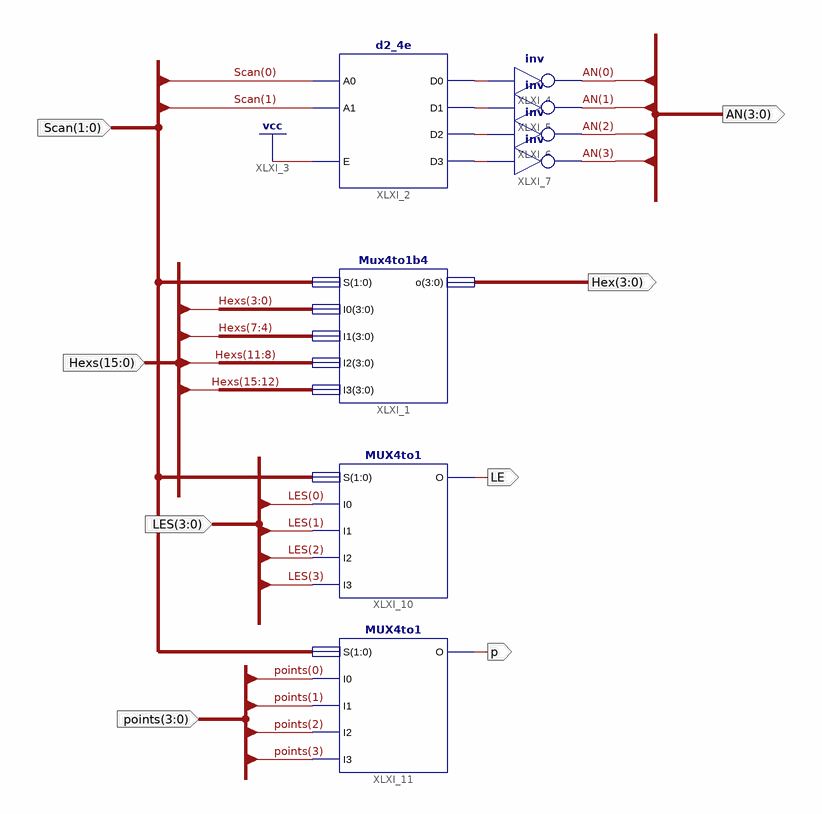
[diagram p0: schematic sheet 1]
// Xilinx ISE schematic DisplaySync.sch (kintex7) as structural Verilog: 8 symbols, 8 ports
module DisplaySync (
  input  [1:0] Scan,
  input  [15:0] Hexs,
  input  [3:0] LES,
  input  [3:0] points,
  output [3:0] Hex,
  output [3:0] AN,
  output p,
  output LE
);

  wire XLXN_13, XLXN_21, XLXN_22, XLXN_23;

  Mux4to1b4 XLXI_1 (.S(Scan), .I0(Hexs[3:0]), .I1(Hexs[7:4]), .I2(Hexs[11:8]), .I3(Hexs[15:12]), .o(Hex));
  d2_4e XLXI_2 (.A0(Scan[0]), .A1(Scan[1]), .E(1'b1), .D0(XLXN_21), .D1(XLXN_22), .D2(XLXN_23), .D3(XLXN_13));
  not XLXI_4 (AN[0], XLXN_21);
  not XLXI_5 (AN[1], XLXN_22);
  not XLXI_6 (AN[2], XLXN_23);
  not XLXI_7 (AN[3], XLXN_13);
  MUX4to1 XLXI_10 (.S(Scan), .I0(LES[0]), .I1(LES[1]), .I2(LES[2]), .I3(LES[3]), .O(LE));
  MUX4to1 XLXI_11 (.S(Scan), .I0(points[0]), .I1(points[1]), .I2(points[2]), .I3(points[3]), .O(p));
endmodule
